# Altium schematic sheet MAIN_BOARD.SchDoc
size A4; SheetNumber: 1; SheetTotal: 6
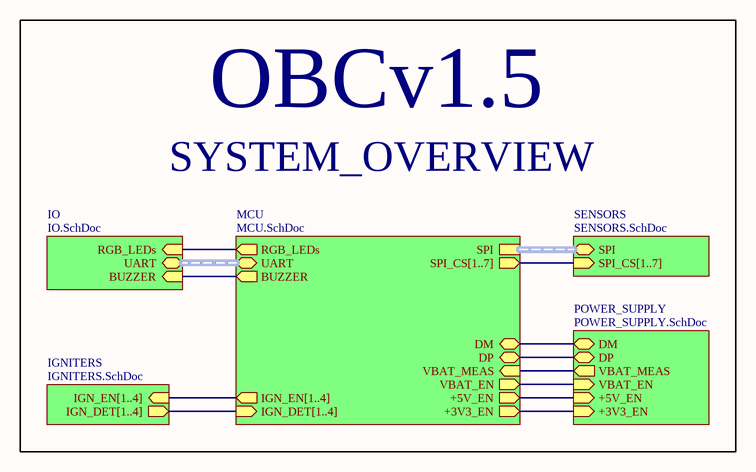
[diagram p0: MAIN_BOARD.SchDoc]

## Sub-sheets
IGNITERS = IGNITERS.SchDoc: IGN_EN[1..4] (in), IGN_DET[1..4] (out)
IO = IO.SchDoc: RGB_LEDs (in), UART (bidir), BUZZER (in)
MCU = MCU.SchDoc: DM (bidir), DP (bidir), IGN_DET[1..4] (in), IGN_EN[1..4] (out), RGB_LEDs (out), VBAT_EN (out), UART (bidir), VBAT_MEAS (in), SPI, SPI_CS[1..7] (out), +5V_EN (out), +3V3_EN (out), BUZZER (out)
POWER_SUPPLY = POWER_SUPPLY.SchDoc: VBAT_MEAS (out), DM (bidir), DP (bidir), VBAT_EN (in), +5V_EN (in), +3V3_EN (in)
SENSORS = SENSORS.SchDoc: SPI (bidir), SPI_CS[1..7] (in)

## Nets
(unnamed): sheet MCU/DM, sheet POWER_SUPPLY/DM
(unnamed): sheet MCU/DP, sheet POWER_SUPPLY/DP
(unnamed): sheet MCU/RGB_LEDs, sheet IO/RGB_LEDs
(unnamed): sheet MCU/VBAT_EN, sheet POWER_SUPPLY/VBAT_EN
(unnamed): sheet MCU/VBAT_MEAS, sheet POWER_SUPPLY/VBAT_MEAS
(unnamed): sheet MCU/+5V_EN, sheet POWER_SUPPLY/+5V_EN
(unnamed): sheet MCU/+3V3_EN, sheet POWER_SUPPLY/+3V3_EN
(unnamed): sheet MCU/BUZZER, sheet IO/BUZZER

## Buses and harness runs
bus sheet IGNITERS/IGN_DET[1..4] = sheet MCU/IGN_DET[1..4]
bus sheet IGNITERS/IGN_EN[1..4] = sheet MCU/IGN_EN[1..4]
bus sheet MCU/SPI_CS[1..7] = sheet SENSORS/SPI_CS[1..7]
harness sheet IO/UART = sheet MCU/UART
harness sheet MCU/SPI = sheet SENSORS/SPI

## Notes on the sheet
- OBCv1.5
- SYSTEM_OVERVIEW